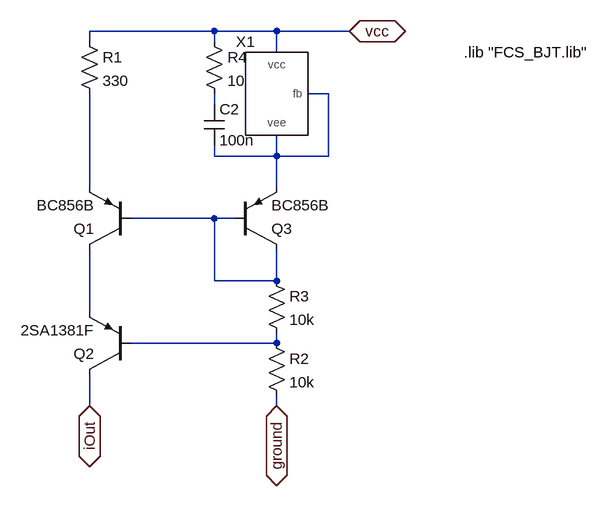
[diagram p0: schematic CS-diff.asc]
CS-diff.asc, the LTspice schematic file:
Version 4
SHEET 1 2264 912
WIRE 256 192 64 192
WIRE 352 192 256 192
WIRE 464 192 352 192
WIRE 64 208 64 192
WIRE 256 208 256 192
WIRE 352 224 352 192
WIRE 432 288 400 288
WIRE 256 304 256 288
WIRE 256 384 256 368
WIRE 352 384 352 352
WIRE 352 384 256 384
WIRE 432 384 432 288
WIRE 432 384 352 384
WIRE 64 432 64 288
WIRE 352 432 352 384
WIRE 256 480 128 480
WIRE 288 480 256 480
WIRE 256 576 256 480
WIRE 352 576 352 528
WIRE 352 576 256 576
WIRE 64 624 64 528
WIRE 352 672 352 656
WIRE 352 672 128 672
WIRE 64 768 64 720
WIRE 352 768 352 752
FLAG 464 192 vcc
IOPIN 464 192 BiDir
FLAG 64 768 iOut
IOPIN 64 768 BiDir
FLAG 352 768 ground
IOPIN 352 768 BiDir
SYMBOL res 48 192 R0
SYMATTR InstName R1
SYMATTR Value 330
SYMBOL pnp 128 528 R180
SYMATTR InstName Q1
SYMATTR Value BC856B
SYMBOL res 336 560 R0
SYMATTR InstName R3
SYMATTR Value 10k
SYMBOL LM136 352 288 R0
SYMATTR InstName X1
SYMBOL pnp 128 720 R180
SYMATTR InstName Q2
SYMATTR Value 2SA1381F
SYMBOL res 336 656 R0
SYMATTR InstName R2
SYMATTR Value 10k
SYMBOL pnp 288 528 M180
SYMATTR InstName Q3
SYMATTR Value BC856B
SYMBOL res 240 192 R0
SYMATTR InstName R4
SYMATTR Value 10
SYMBOL cap 240 304 R0
SYMATTR InstName C2
SYMATTR Value 100n
TEXT 640 224 Left 0 !.lib "FCS_BJT.lib"

The netlist it stands for:
* CS-diff.asc
R1 vcc N003 330
Q1 N005 N004 N003 0 BC856B
R3 N004 N006 10k
XX1 N001 vcc N001 LM136  ; pins fb vcc vee
Q2 iOut N006 N005 0 2SA1381F
R2 N006 ground 10k
Q3 N004 N004 N001 0 BC856B
R4 vcc N002 10
C2 N002 N001 100n
.model NPN NPN
.model PNP PNP
.lib standard.bjt
.lib "FCS_BJT.lib"
.backanno
.end